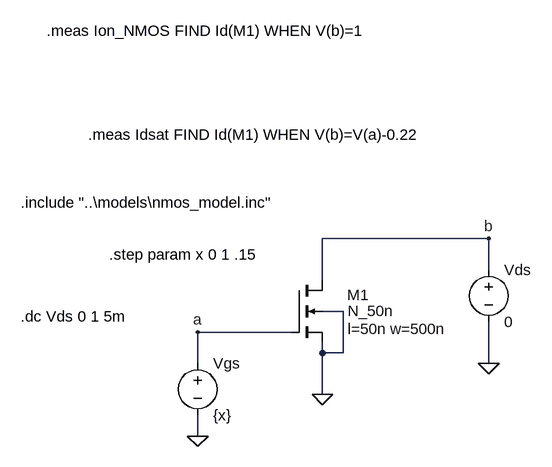
[diagram p0: schematic nmos_Id_Vds.asc]
nmos_Id_Vds.asc, the LTspice schematic file:
Version 4.1
SHEET 1 880 800
WIRE 496 64 240 64
WIRE 496 112 496 64
WIRE 240 128 240 64
WIRE 272 176 240 176
WIRE 192 208 48 208
WIRE 240 240 240 224
WIRE 272 240 272 176
WIRE 272 240 240 240
WIRE 48 256 48 208
WIRE 496 256 496 192
WIRE 240 304 240 240
WIRE 48 368 48 336
FLAG 48 368 0
FLAG 240 304 0
FLAG 496 256 0
FLAG 496 64 b
FLAG 48 208 a
SYMBOL nmos4 192 128 R0
WINDOW 0 86 23 Left 2
WINDOW 3 87 47 Left 2
WINDOW 123 87 75 Left 2
SYMATTR InstName M1
SYMATTR Value N_50n
SYMATTR Value2 l=50n w=500n
SYMBOL voltage 48 240 R0
WINDOW 123 0 0 Left 0
WINDOW 39 0 0 Left 0
SYMATTR InstName Vgs
SYMATTR Value {x}
SYMBOL voltage 496 96 R0
SYMATTR InstName Vds
SYMATTR Value 0
TEXT -224 8 Left 2 !.include "..\\models\\nmos_model.inc"
TEXT -224 184 Left 2 !.dc Vds 0 1 5m
TEXT -88 88 Left 2 !.step param x 0 1 .15
TEXT -120 -96 Left 2 !.meas Idsat FIND Id(M1) WHEN V(b)=V(a)-0.22
TEXT -184 -256 Left 2 !.meas Ion_NMOS FIND Id(M1) WHEN V(b)=1

The netlist it stands for:
* nmos_Id_Vds.asc
M1 b a 0 0 N_50n l=50n w=500n
Vgs a 0 {x}
Vds b 0 0
.model NMOS NMOS
.model PMOS PMOS
.lib standard.mos
.include "..\models\nmos_model.inc"
.dc Vds 0 1 5m
.step param x 0 1 .15
.meas Idsat FIND Id(M1) WHEN V(b)=V(a)-0.22
.meas Ion_NMOS FIND Id(M1) WHEN V(b)=1
.backanno
.end